# Altium schematic sheet DAAD_DIMER_Sheet.SchDoc: Багатоканальний пристрій регулювання потужності
size 420 x 297 mm; ApprovedBy: Хоменко М.А.; CheckedBy: Хоменко М.А.; Author: Шокодько Д.А.; CompanyName: НУЧП; DocumentNumber: МРА.EH 14194617; Revision: Хоменко М.А.; SheetNumber: 1; SheetTotal: 4; Scale: 1:1; Title2str: електричних нагрівальних елементів; DocumentType: Схема електрична принципова; FirstReferrence: АБВГ.123456.001; T_Contr: Хоменко М.А.; N_Contr: Хоменко М.А.
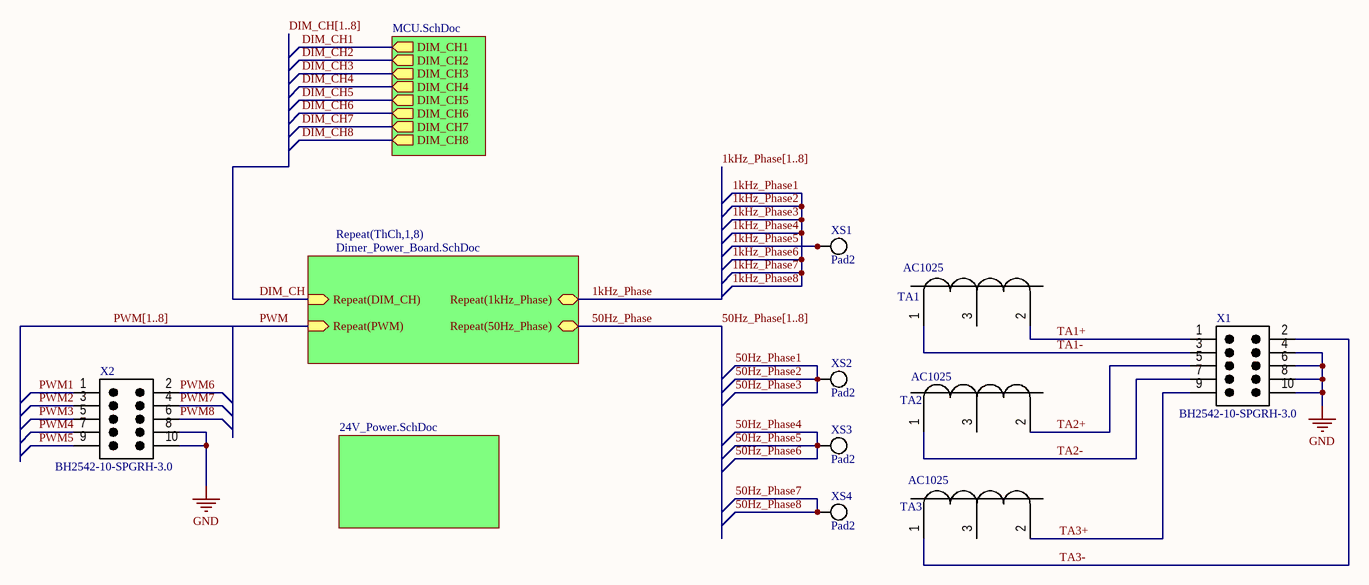
[diagram p0: DAAD_DIMER_Sheet.SchDoc]

## Parts
TA1  AC1025  [10K_TRIM]
TA2  AC1025  [10K_TRIM]
TA3  AC1025  [10K_TRIM]
X1  BH2542-10-SPGRH-3.0  [PCE-BH2542-10-SPGRH-3.0]
X2  BH2542-10-SPGRH-3.0  [PCE-BH2542-10-SPGRH-3.0]
XS1  Pad2  [LOTPAD_2]
XS2  Pad2  [LOTPAD_2]
XS3  Pad2  [LOTPAD_2]
XS4  Pad2  [LOTPAD_2]

## Sub-sheets
24V_Power = 24V_Power.SchDoc: no entries
Designator = MCU.SchDoc: DIM_CH2 (out), DIM_CH5 (out), DIM_CH8 (out), DIM_CH6 (out), DIM_CH4 (out), DIM_CH3 (out), DIM_CH7 (out), DIM_CH1 (out)
Repeat(ThCh,1,8) = Dimer_Power_Board.SchDoc: Repeat(PWM) (in), Repeat(50Hz_Phase) (bidir), Repeat(DIM_CH) (in), Repeat(1kHz_Phase) (bidir)

## Nets
GND: X1.4 X1.6 X1.8 X1.10 X2.8 X2.10
1kHz_Phase: sheet Repeat(ThCh,1,8)/Repeat(1kHz_Phase)
1kHz_Phase5: XS1.1 XS1.2
50Hz_Phase: sheet Repeat(ThCh,1,8)/Repeat(50Hz_Phase)
50Hz_Phase1: XS2.1 XS2.2  [also labelled 50Hz_Phase2, 50Hz_Phase3]
50Hz_Phase4: XS3.1 XS3.2  [also labelled 50Hz_Phase5, 50Hz_Phase6]
50Hz_Phase7: XS4.1 XS4.2  [also labelled 50Hz_Phase8]
DIM_CH: sheet Repeat(ThCh,1,8)/Repeat(DIM_CH)
DIM_CH1: sheet Designator/DIM_CH1
DIM_CH2: sheet Designator/DIM_CH2
DIM_CH3: sheet Designator/DIM_CH3
DIM_CH4: sheet Designator/DIM_CH4
DIM_CH5: sheet Designator/DIM_CH5
DIM_CH6: sheet Designator/DIM_CH6
DIM_CH7: sheet Designator/DIM_CH7
DIM_CH8: sheet Designator/DIM_CH8
PWM: sheet Repeat(ThCh,1,8)/Repeat(PWM)
PWM1: X2.1
PWM2: X2.3
PWM3: X2.5
PWM4: X2.7
PWM5: X2.9
PWM6: X2.2
PWM7: X2.4
PWM8: X2.6
TA1+: TA1.2 X1.1
TA1-: TA1.1 X1.3
TA2+: TA2.2 X1.5
TA2-: TA2.1 X1.7
TA3+: TA3.2 X1.9
TA3-: TA3.1 X1.2

Not connected (* = marked no-connect by the designer): TA1 3; TA2 3; TA3 3

## Buses and harness runs
bus 1kHz_Phase[1..8]
bus 50Hz_Phase[1..8]
bus DIM_CH[1..8]
bus PWM[1..8]

## Notes on the sheet
- Перше використання
- Довідн. №
- Підп. і дата
- Інв. № дубл.
- Взамін інв. №
- Розроб.
- Зм.
- Лист
- № докум.
- Підп.
- Дата
- Літ.
- Маса
- Масштаб
- Перевір.
- Т.контр.
- Листів
- Інв. № оригін.
- Затв.
- Н.контр.
- 2.106-A3
- Формат А3

## Library data of the parts
TA1-TA3 = Talema 45/15 AC1025: Talema India Current Trancducer 45/15 AC1025
X1 X2 = PCE-HDR-2P-M-R10: Box Header, Pitch 2.54 mm, 2x5 Position, Height 9 mm, Tail Length 3 mm; Manufacturer: Pinchao Electronic; Insulator Material: NY-6T; Insulator resistance (Min.): 1000 Megohms; Plating: Gold Flash; No. of positions: 10; No. of Rows: 2; Dielectric Withstaanding: AC 500 V; Current Rating: 3 Amps; Pitch: 2.54 mm; ComponentLink1Description: Manufacturer URL; PartNumber: BH2542-10-SPGRH-3.0; PackageReference: BH2542-10-SPGRH-3.0; ComponentLink1URL: http://www.suzhoupinchao.com/; PackageDescription: Box Header, Pitch 2.54 mm, 2x5 Position, Height 9 mm, Tail Length 3 mm; Connector Type: Box Header; Mounting Technology: Through Hole; Operating Temperature: -40 to 105 degC
XS1-XS4 = Pad2: PCB TH Pad